# Altium schematic sheet Project A.SchDoc
size A; SheetNumber: 1; SheetTotal: 1
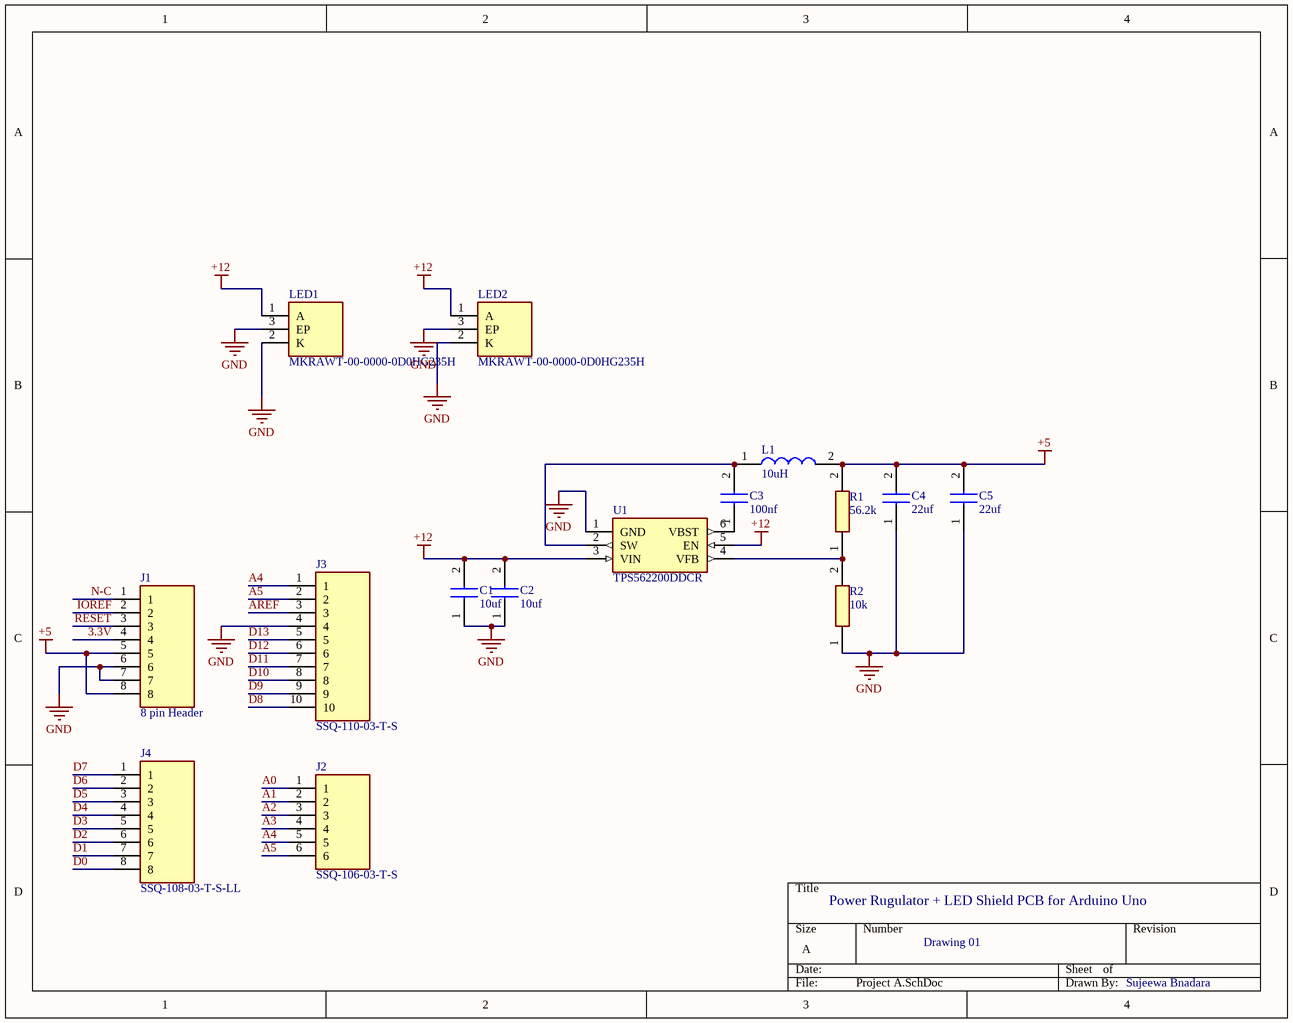
[diagram p0: Project A.SchDoc]

## Parts
C1  10uf  [C2012_Commercial]
C2  10uf  [C2012_Commercial]
C3  100nf  [CAPC2012X94N]
C4  22uf  [CAPC1608X80N]
C5  22uf  [CAPC1608X80N]
J1  8 pin Header  [SSQ10803TSLL]
J2  SSQ-106-03-T-S  [RHDR6W64P254_1X6_1575X241X851P]
J3  SSQ-110-03-T-S  [RHDR10W64P254_1X10_2591X241X851P]
J4  SSQ-108-03-T-S-LL  [SSQ10803TSLL]
L1  10uH  [SRN6045_1]
LED1  MKRAWT-00-0000-0D0HG235H  [MKRAWT0000000D0HG235H]
LED2  MKRAWT-00-0000-0D0HG235H  [MKRAWT0000000D0HG235H]
R1  56.2k  [RESC0603X26N]
R2  10k  [RESC0603X26N]
U1  TPS562200DDCR  [SOT95P280X110-6N]

## Nets
+5: C4.2 C5.2 J1.5 J1.8 L1.2 R1.2
+12: C1.2 C2.2 LED1.1(A) LED2.1(A) U1.3(VIN) U1.5(EN)
GND: C1.1 C2.1 C4.1 C5.1 J1.6 J1.7 J3.4 LED1.2(K) LED1.3(EP) LED2.2(K) LED2.3(EP) R2.1 U1.1(GND)
3.3V: J1.4
A0: J2.1
A1: J2.2
A2: J2.3
A3: J2.4
A4: J2.5 J3.1
A5: J2.6 J3.2
AREF: J3.3
D0: J4.8
D1: J4.7
D2: J4.6
D3: J4.5
D4: J4.4
D5: J4.3
D6: J4.2
D7: J4.1
D8: J3.10
D9: J3.9
D10: J3.8
D11: J3.7
D12: J3.6
D13: J3.5
IOREF: J1.2
N-C: J1.1
RESET: J1.3
NetC3_1: C3.1 U1.6(VBST)
NetC3_2: C3.2 L1.1 U1.2(SW)
NetR1_1: R1.1 R2.2 U1.4(VFB)

## Notes on the sheet
- Power Rugulator + LED Shield PCB for Arduino Uno
- Drawing 01
- Sujeewa Bnadara

## Library data of the parts
C1 C2 = C2012X5R1V106K085AC: Capacitor; Manufacturer_Name: TDK; Datasheet Link: https://product.tdk.com/system/files/dam/doc/product/capacitor/ceramic/mlcc/catalog/mlcc_commercial_general_en.pdf; Height: 0.75mm; Manufacturer_Part_Number: C2012X5R1V106K085AC; Mouser Part Number: 810-C2012X5R1V106K0C; Mouser Price/Stock: https://www.mouser.co.uk/ProductDetail/TDK/C2012X5R1V106K085AC?qs=6JAMGB%252BEdky%252BlYMcTLhFyA%3D%3D; Arrow Part Number: C2012X5R1V106K085AC; Arrow Price/Stock: https://www.arrow.com/en/products/c2012x5r1v106k085ac/tdk?region=nac
C3 = 08053C104KAT2A: Capacitor; Manufacturer_Name: AVX; Datasheet Link: http://datasheets.avx.com/X7RDielectric.pdf; Height: 0.94mm; Manufacturer_Part_Number: 08053C104KAT2A; Mouser Part Number: 581-08053C104K; Mouser Price/Stock: https://www.mouser.co.uk/ProductDetail/AVX/08053C104KAT2A?qs=EihRZLdKnF2GcTBzDkE%2FiQ%3D%3D; Arrow Part Number: 08053C104KAT2A; Arrow Price/Stock: https://www.arrow.com/en/products/08053c104kat2a/avx
C4 C5 = C1608X5R1A226M080AC: Capacitor; Manufacturer_Name: TDK; Datasheet Link: https://product.tdk.com/info/en/catalog/datasheets/mlcc_commercial_midvoltage_en.pdf; Height: 0.8mm; Manufacturer_Part_Number: C1608X5R1A226M080AC; Mouser Part Number: 810-C1608X5R1A226M; Mouser Price/Stock: https://www.mouser.co.uk/ProductDetail/TDK/C1608X5R1A226M080AC?qs=dfay7wIA1uED3Fb1o4f9Dg%3D%3D; Arrow Part Number: C1608X5R1A226M080AC; Arrow Price/Stock: https://www.arrow.com/en/products/c1608x5r1a226m080ac/tdk?region=nac
J1 J4 = SSQ-108-03-T-S-LL: Connector; Manufacturer_Name: SAMTEC; Datasheet Link: https://www.mouser.co.id/datasheet/2/527/ssq_th-1370157.pdf; Height: 8.51mm; Manufacturer_Part_Number: SSQ-108-03-T-S-LL; Mouser Part Number: 200-SSQ-108-03-TSLL; Mouser Price/Stock: https://www.mouser.co.uk/ProductDetail/Samtec/SSQ-108-03-T-S-LL?qs=u16ybLDytRb9A9bYMPUG2Q%3D%3D; Arrow Part Number: SSQ-108-03-T-S-LL; Arrow Price/Stock: https://www.arrow.com/en/products/ssq-108-03-t-s-ll/samtec?region=nac
J2 = SSQ-106-03-T-S: Connector; Manufacturer_Name: SAMTEC; Datasheet Link: http://suddendocs.samtec.com/prints/ssq-1xx-xx-xxx-x-xx-xxx-xx-x-mkt.pdf; Height: 8.51mm; Manufacturer_Part_Number: SSQ-106-03-T-S; Mouser Part Number: 200-SSQ10603TS; Mouser Price/Stock: https://www.mouser.co.uk/ProductDetail/Samtec/SSQ-106-03-T-S?qs=rU5fayqh%252BE1MgKYVKa8USw%3D%3D; Arrow Part Number: SSQ-106-03-T-S; Arrow Price/Stock: https://www.arrow.com/en/products/ssq-106-03-t-s/samtec?region=nac
J3 = SSQ-110-03-T-S: Connector; Manufacturer_Name: SAMTEC; Datasheet Link: http://suddendocs.samtec.com/prints/ssq-1xx-xx-xxx-x-xx-xxx-xx-x-mkt.pdf; Height: 8.51mm; Manufacturer_Part_Number: SSQ-110-03-T-S; Mouser Part Number: 200-SSQ11003TS; Mouser Price/Stock: https://www.mouser.co.uk/ProductDetail/Samtec/SSQ-110-03-T-S?qs=rU5fayqh%252BE0uAJE8UTgxfA%3D%3D; Arrow Part Number: SSQ-110-03-T-S; Arrow Price/Stock: https://www.arrow.com/en/products/ssq-110-03-t-s/samtec?region=nac
L1 = SRN6045-4R7Y: Inductor; Manufacturer_Name: Bourns; Datasheet Link: https://www.bourns.com/data/global/pdfs/SRN6045.pdf; Manufacturer_Part_Number: SRN6045-4R7Y; Mouser Part Number: 652-SRN6045-4R7Y; Mouser Price/Stock: https://www.mouser.co.uk/ProductDetail/Bourns/SRN6045-4R7Y?qs=opBjA1TV902tB4tumIiZhg%3D%3D; Arrow Part Number: SRN6045-4R7Y; Arrow Price/Stock: https://www.arrow.com/en/products/srn6045-4r7y/bourns?region=nac
LED1 LED2 = MKRAWT-00-0000-0D0HG235H: LED; Manufacturer_Name: CREE LED; Datasheet Link: https://nl.mouser.com/datasheet/2/723/XLampMKR-2327143.pdf; Height: 4.21mm; Manufacturer_Part_Number: MKRAWT-00-0000-0D0HG235H; Mouser Part Number: 941-MKRAWT0D0HG235H; Mouser Price/Stock: https://www.mouser.co.uk/ProductDetail/Cree-LED/MKRAWT-00-0000-0D0HG235H?qs=TqB%2FzLOUcHLtwo74coesIQ%3D%3D; Arrow Part Number: MKRAWT-00-0000-0D0HG235H; Arrow Price/Stock: https://www.arrow.com/en/products/mkrawt-00-0000-0d0hg235h/cree-led?region=nac
R1 = RC0201FR-0756K2L: Resistor; Manufacturer_Name: KEMET; Datasheet Link: http://www.yageo.com/documents/recent/PYu-RC0201_51_RoHS_L_8.pdf; Height: 0.26mm; Manufacturer_Part_Number: RC0201FR-0756K2L; Mouser Part Number: 603-RC0201FR-0756K2L; Mouser Price/Stock: https://www.mouser.co.uk/ProductDetail/YAGEO/RC0201FR-0756K2L?qs=Q4gDqC5t5%2FD3%2Fkjmz2Nr%2Fw%3D%3D; Arrow Part Number: RC0201FR-0756K2L; Arrow Price/Stock: https://www.arrow.com/en/products/rc0201fr-0756k2l/yageo?region=nac
R2 = RC0201FR-0710KL: Resistor; Manufacturer_Name: KEMET; Datasheet Link: http://www.yageo.com/documents/recent/PYu-RC0201_51_RoHS_L_8.pdf; Height: 0.26mm; Manufacturer_Part_Number: RC0201FR-0710KL; Mouser Part Number: 603-RC0201FR-0710KL; Mouser Price/Stock: https://www.mouser.co.uk/ProductDetail/YAGEO/RC0201FR-0710KL?qs=FLc6udek5PS1AiJCgpc6bQ%3D%3D
U1 = TPS562200DDCR: Undefined or Miscellaneous; Manufacturer_Name: Texas Instruments; Datasheet Link: http://www.ti.com/lit/gpn/tps562200; Height: 1.1mm; Manufacturer_Part_Number: TPS562200DDCR; Mouser Part Number: 595-TPS562200DDCR; Mouser Price/Stock: https://www.mouser.co.uk/ProductDetail/Texas-Instruments/TPS562200DDCR?qs=7wMBv%2Ftbz9Jdis0htpD4wA%3D%3D; Arrow Part Number: TPS562200DDCR; Arrow Price/Stock: https://www.arrow.com/en/products/tps562200ddcr/texas-instruments?region=nac